# EAGLE design 10DOF_FeatherWing (EAGLE 7.5.0)
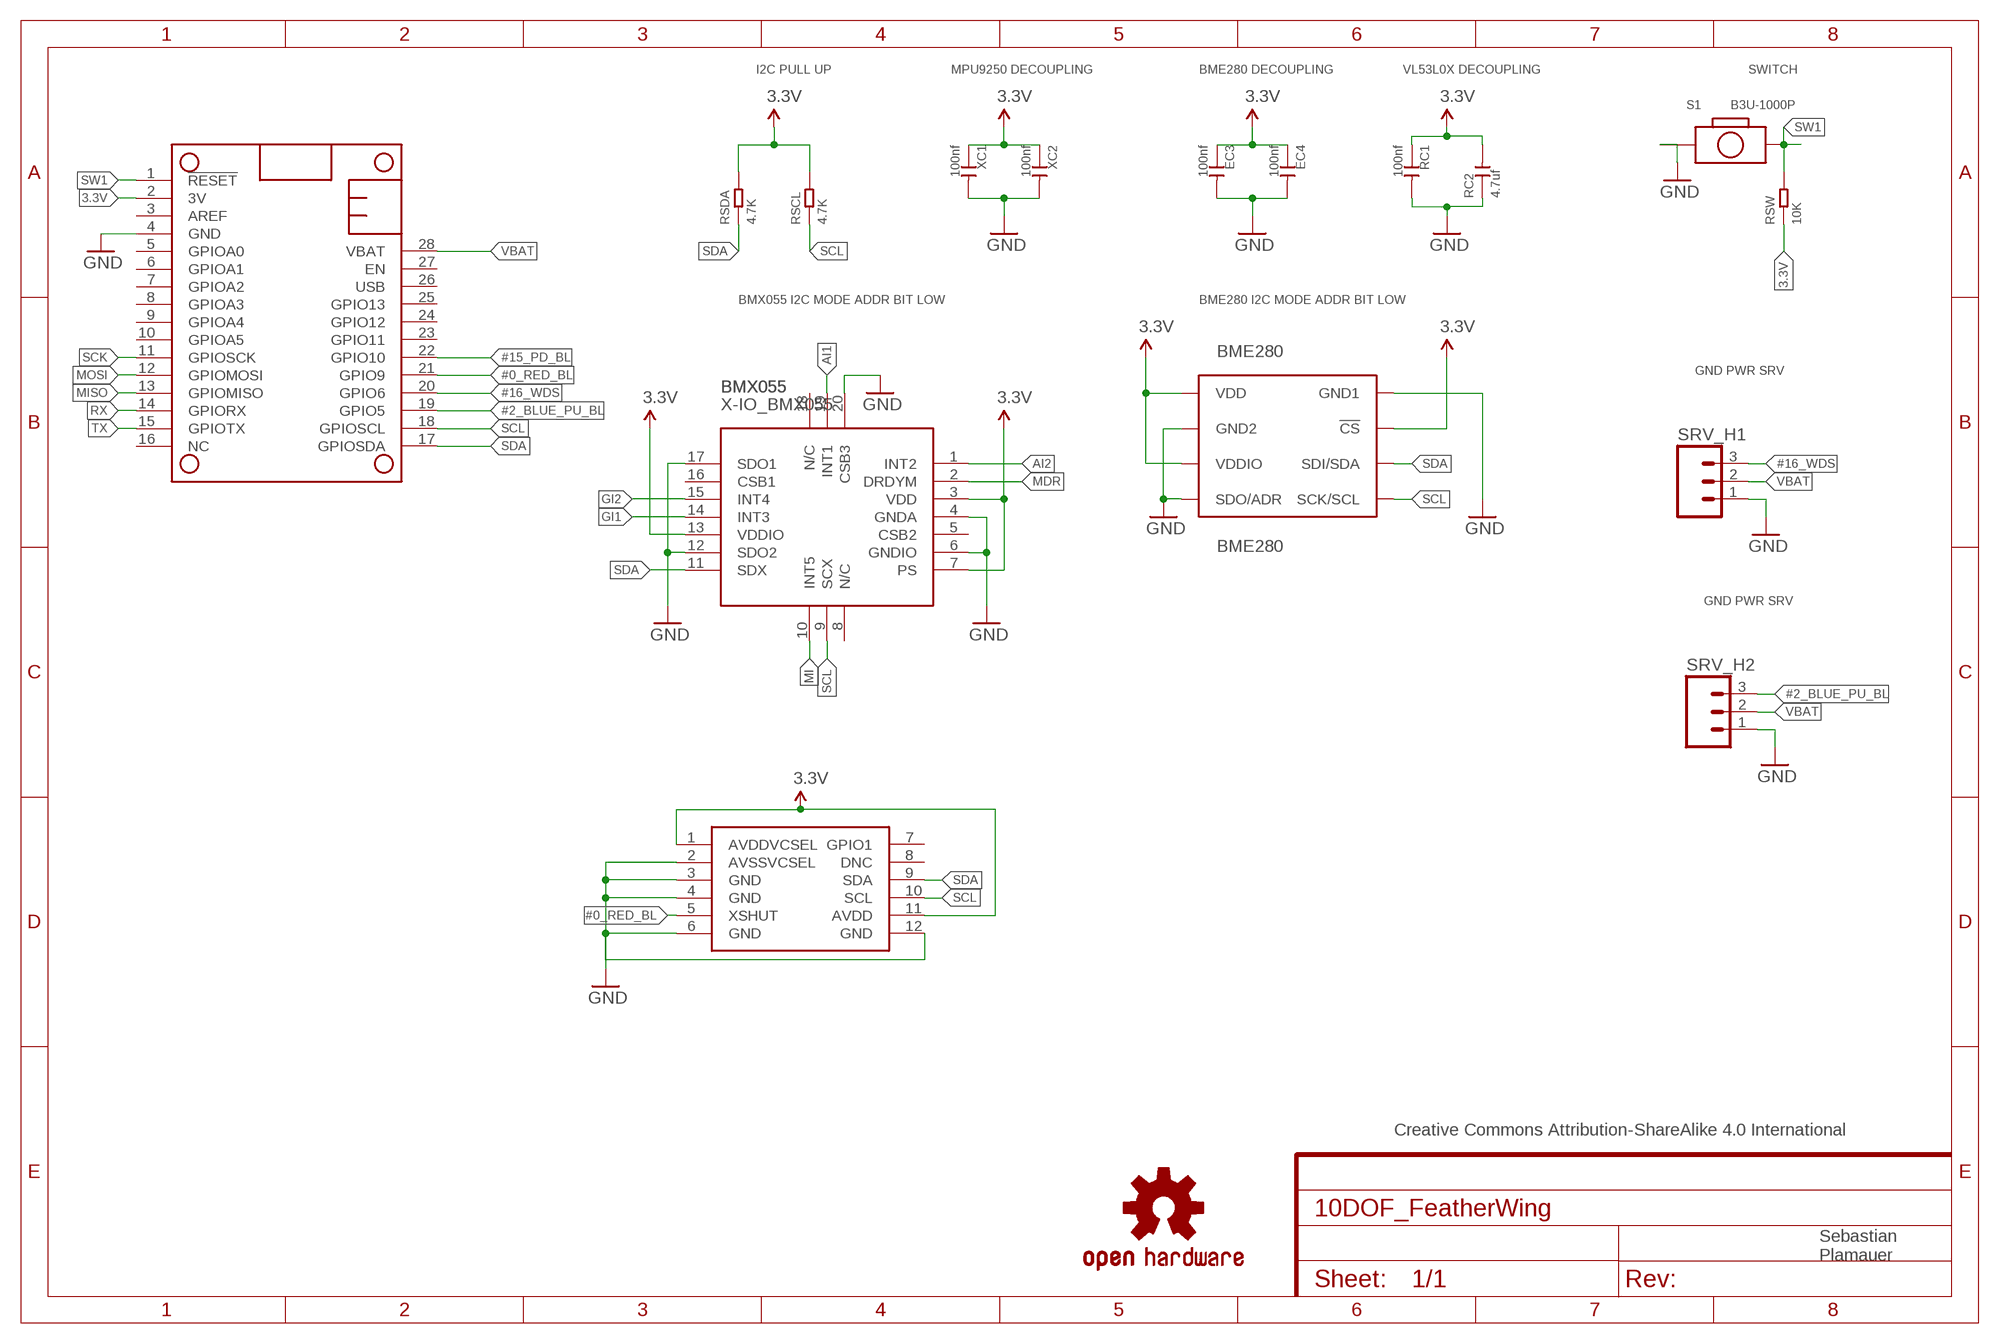
[diagram p0: schematic, sheet 1]

## Parts
BME280  BME280  BME280COMPONENTLIBRARY_BME280  [BME280COMPONENTLIBRARY_BME280_LGA]
BMX055  X-IO_BMX055  [X-IO_BMX055]
EC3  100nf  CERAMIC-100NF-50V-10%-X7R(0603)  [C0603]
EC4  100nf  CERAMIC-100NF-50V-10%-X7R(0603)  [C0603]
LOGO1  OSHW-LOGOS  [OSHW-LOGO-S]
MS1  FEATHERWING  [FEATHERWING]
RC1  100nf  CERAMIC-100NF-50V-10%-X7R(0603)  [C0603]
RC2  4.7uf  CERAMIC-4.7UF-10V-10%-X5R(0603)  [C0603]
RSCL  4.7K  SMD-RES-4.7K-5%-1/10W(0603)  [R0603]
RSDA  4.7K  SMD-RES-4.7K-5%-1/10W(0603)  [R0603]
RSW  10K  SMD-RES-10K-1%-1/10W(0603)  [R0603]
S1  B3U-1000P  SMD-BUTTON-WITHOUT-BOSS-(2P-3X2.5MM)  [SW2-SMD-3.0X2.5X1.2+0.4MM]
SRV_H1  M03PTH  [1X03]
SRV_H2  M03PTH  [1X03]
U$1  VL53L0X  [VL53L0X]
XC1  100nf  CERAMIC-100NF-50V-10%-X7R(0603)  [C0603]
XC2  100nf  CERAMIC-100NF-50V-10%-X7R(0603)  [C0603]

## Nets
3.3V: BME280.P$2(!CS) BME280.P$6(VDDIO) BME280.P$8(VDD) BMX055.3(VDD) BMX055.7(PS) BMX055.13(VDDIO) EC3.1 EC4.1 MS1.2(3V) RC1.1 RC2.2 RSCL.2 RSDA.2 RSW.1 U$1.1(AVDDVCSEL) U$1.11(AVDD) XC1.1 XC2.1
#0_RED_BL: MS1.21(GPIO9) U$1.5(XSHUT)
#2_BLUE_PU_BL: MS1.19(GPIO5) SRV_H2.3
#15_PD_BL: MS1.22(GPIO10)
#16_WDS: MS1.20(GPIO6) SRV_H1.3
AI1: BMX055.19(INT1)
AI2: BMX055.1(INT2)
GI1: BMX055.14(INT3)
GI2: BMX055.15(INT4)
GND: BME280.P$1(GND1) BME280.P$5(SDO/ADR) BME280.P$7(GND2) BMX055.4(GNDA) BMX055.6(GNDIO) BMX055.12(SDO2) BMX055.17(SDO1) BMX055.20(CSB3) EC3.2 EC4.2 MS1.4(GND) RC1.2 RC2.1 S1.1 SRV_H1.1 SRV_H2.1 U$1.2(AVSSVCSEL) U$1.3(GND) U$1.4(GND) U$1.6(GND) U$1.12(GND) XC1.2 XC2.2
MDR: BMX055.2(DRDYM)
MI: BMX055.10(INT5)
MISO: MS1.13(GPIOMISO)
MOSI: MS1.12(GPIOMOSI)
RX: MS1.14(GPIORX)
SCK: MS1.11(GPIOSCK)
SCL: BME280.P$4(SCK/SCL) BMX055.9(SCX) MS1.18(GPIOSCL) RSCL.1 U$1.10(SCL)
SDA: BME280.P$3(SDI/SDA) BMX055.11(SDX) MS1.17(GPIOSDA) RSDA.1 U$1.9(SDA)
SW1: MS1.1(!RESET) RSW.2 S1.2
TX: MS1.15(GPIOTX)
VBAT: MS1.28(VBAT) SRV_H1.2 SRV_H2.2
Unconnected: BMX055.5(CSB2) BMX055.8(N/C) BMX055.16(CSB1) BMX055.18(N/C) MS1.3(AREF) MS1.5(GPIOA0) MS1.6(GPIOA1) MS1.7(GPIOA2) MS1.8(GPIOA3) MS1.9(GPIOA4) MS1.10(GPIOA5) MS1.16(NC) MS1.23(GPIO11) MS1.24(GPIO12) MS1.25(GPIO13) MS1.26(USB) MS1.27(EN) U$1.7(GPIO1) U$1.8(DNC)

## Notes on the sheet
- I2C PULL UP | MPU9250 DECOUPLING | BME280 DECOUPLING | VL53L0X DECOUPLING | SWITCH
- BMX055 I2C MODE ADDR BIT LOW | BME280 I2C MODE ADDR BIT LOW
- GND PWR SRV
- GND PWR SRV
- Creative Commons Attribution-ShareAlike 4.0 International
- Sebastian
  Plamauer

## Library data of the parts
BME280 = SparkFun_BME280_Breakout_v10:BME280COMPONENTLIBRARY_BME280; PROD_ID: IC-13090
BMX055 = BMX055 Breakout:X-IO_BMX055
EC3 EC4 RC1 XC1 XC2 = Seeed-OPL-Capacitor:CERAMIC-100NF-50V-10%-X7R(0603): 302010138; MPN: CC0603KRX7R9BB104
LOGO1 = SparkFun-Aesthetics:OSHW-LOGO: Open Source Hardware Logo This logo indicates the piece of hardware it is found on incorporates a OSHW license and/or adheres to the definition of open source hardware found here: http://freedomdefined.org/OSHW
MS1 = adafruit:FEATHERWING
RC2 = Seeed-OPL-Capacitor:CERAMIC-4.7UF-10V-10%-X5R(0603): 302010111; MPN: CC0603KRX5R6BB475
RSCL RSDA = Seeed-OPL-Resistor:SMD-RES-4.7K-5%-1/10W(0603): 301010290; MPN: RC0603JR-074K7L
RSW = Seeed-OPL-Resistor:SMD-RES-10K-1%-1/10W(0603): 301010299; MPN: RC0603FR-0710KL
S1 = Seeed-OPL-Button:SMD-BUTTON-WITHOUT-BOSS-(2P-3X2.5MM): 311020047; MPN: B3U-1000P
SRV_H1 SRV_H2 = SparkFun-Connectors:M03: Header 3 Standard 3-pin 0.1" header. Use with straight break away headers (SKU : PRT-00116), right angle break away headers (PRT-00553), swiss pins (PRT-00743), machine pins (PRT-00117), and female headers (PRT-00115). Molex polarized connector foot print use with SKU : PRT-08232 with associated crimp pins and housings.
U$1 = VL53L0X:VL53L0X

## Board
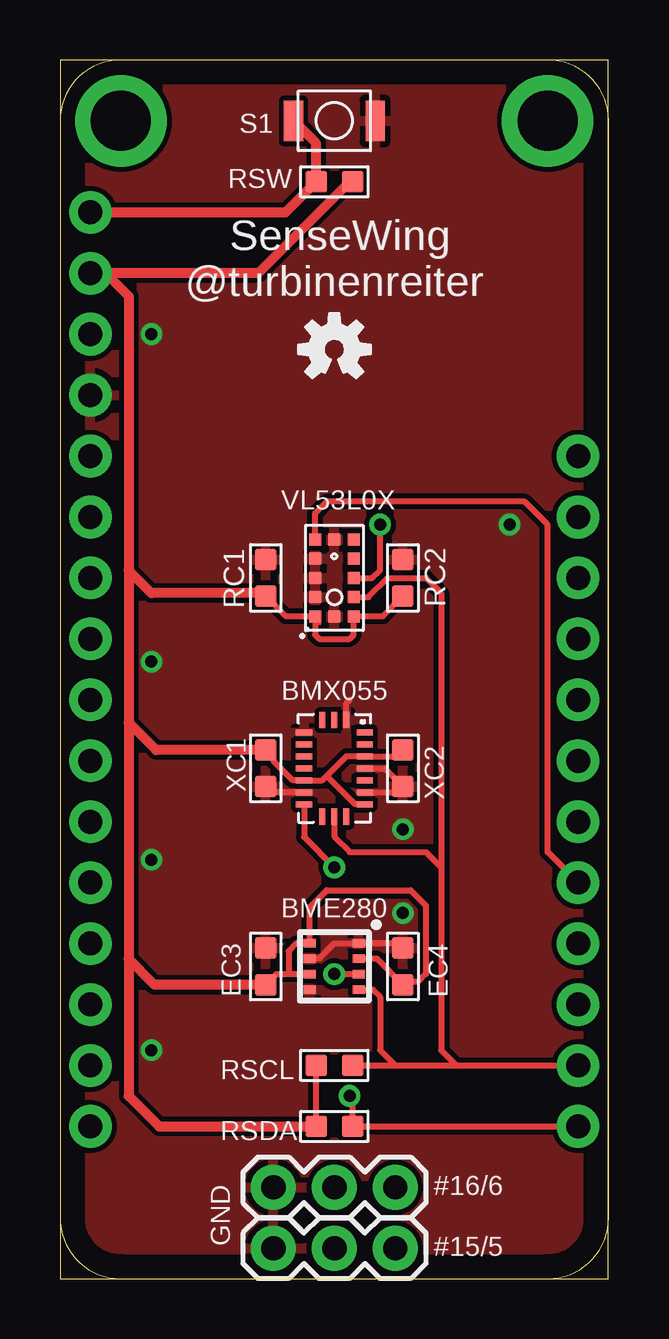
[diagram p1: board, top side]
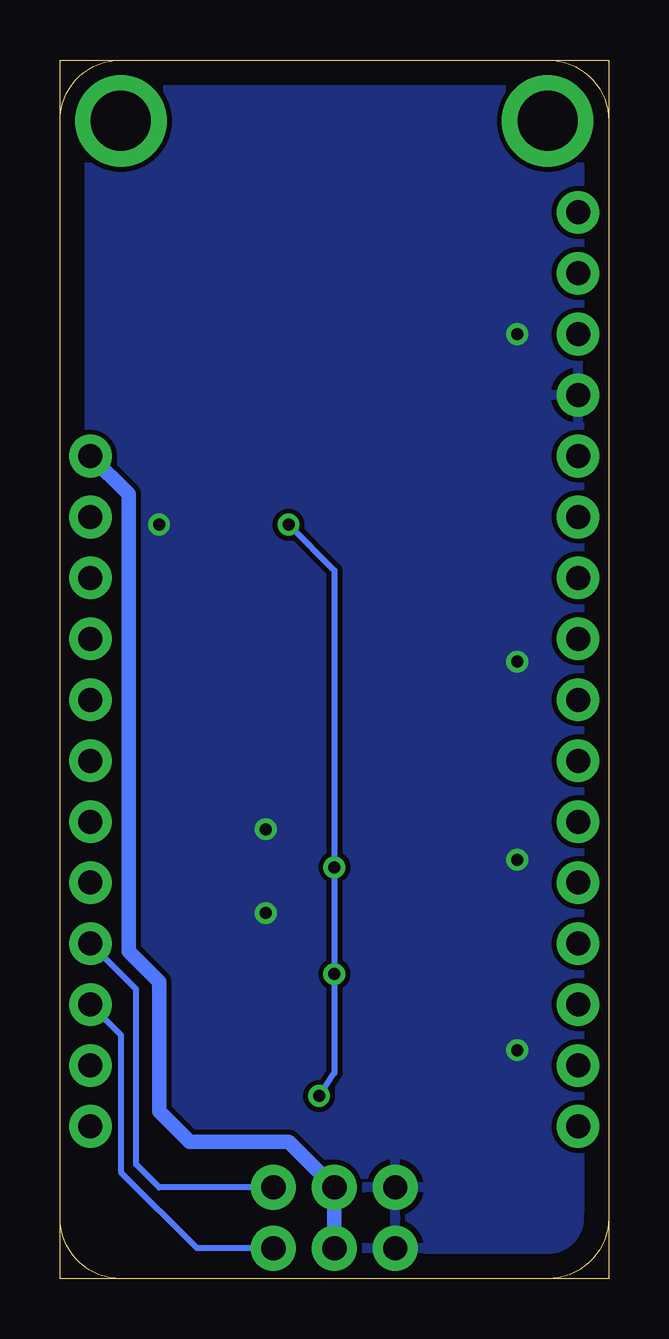
[diagram p2: board, bottom side, seen from below]

Size 22.86 x 50.8 mm. Coordinates in mm from the lower left corner, seen from the top.
Outline: 0,0 22.85,0 22.85,50.79 0,50.79 0,0
Copper layers (1*16): Top 0.035mm / dielectric 1.5mm / Bottom 0.035mm
Design rules "default": minimum track width 10mil, minimum drill 24mil, track to track 8mil, track to pad 8mil, pad to pad 8mil, via to via 8mil, smd to smd 8mil, copper to edge 40mil, drill to drill 8mil, minimum pad ring 10mil, minimum via ring 8mil, stop-mask expansion 4mil, vias tented up to drill 0mil, thermal gap 10mil

### Footprints (pad centres in the part's own frame; a part is rotated, then mirrored left to right if it is on the bottom)
BME280COMPONENTLIBRARY_BME280_LGA = smd 0.5 x 0.35: P$1 1.025,0.975; P$2 1.025,0.325; P$3 1.025,-0.325; P$4 1.025,-0.975; P$5 -1.025,-0.975; P$6 -1.025,-0.325; P$7 -1.025,0.325; P$8 -1.025,0.975
X-IO_BMX055 = smd 0.675 x 0.25: 1 1.262,1.5; 2 1.262,1; 3 1.262,0.5; 4 1.262,0; 5 1.262,-0.5; 6 1.262,-1; 7 1.262,-1.5; 11 -1.262,-1.5; 12 -1.262,-1; 13 -1.262,-0.5; 14 -1.262,0; 15 -1.262,0.5; 16 -1.262,1; 17 -1.262,1.5 | smd 0.25 x 0.675: 8 0.5,-2.013; 9 0,-2.013; 10 -0.5,-2.013; 18 -0.5,2.013; 19 0,2.013; 20 0.5,2.013
C0603 = smd 0.889 x 0.889: 1 0,0.762; 2 0,-0.762
FEATHERWING = drill 1 pad 1.778: 1 6.35,1.27; 2 8.89,1.27; 3 11.43,1.27; 4 13.97,1.27; 5 16.51,1.27; 6 19.05,1.27; 7 21.59,1.27; 8 24.13,1.27; 9 26.67,1.27; 10 29.21,1.27; 11 31.75,1.27; 12 34.29,1.27; 13 36.83,1.27; 14 39.37,1.27; 15 41.91,1.27; 16 44.45,1.27; 17 44.45,21.59; 18 41.91,21.59; 19 39.37,21.59; 20 36.83,21.59; 21 34.29,21.59; 22 31.75,21.59; 23 29.21,21.59; 24 26.67,21.59; 25 24.13,21.59; 26 21.59,21.59; 27 19.05,21.59; 28 16.51,21.59 | drill 2.5 pad 3.81: P$1 2.54,20.32; P$2 2.54,2.54
R0603 = smd 0.889 x 0.889: 1 0,0.762; 2 0,-0.762
SW2-SMD-3.0X2.5X1.2+0.4MM = smd 0.8 x 1.7: 1 -1.7,0; 2 1.7,0
1X03 = drill 1.016 pad 1.88: 1 0,0; 2 2.54,0; 3 5.08,0
VL53L0X = smd 0.5 x 0.5: 1 0.8,1.6; 2 0.8,0.8; 3 0.8,0; 4 0.8,-0.8; 5 0.8,-1.6; 6 0,-1.6; 7 -0.8,-1.6; 8 -0.8,-0.8; 9 -0.8,0; 10 -0.8,0.8; 11 -0.8,1.6; 12 0,1.6

### Placement (x,y rotation side)
BME280  11.43,13.02 0 top
BMX055  11.43,21.27 0 top
EC3  8.57,13.02 180 top
EC4  14.29,13.02 180 top
LOGO1  11.43,38.73 0 top
MS1  0,50.8 270 top
RC1  8.57,29.21 180 top
RC2  14.29,29.21 0 top
RSCL  11.43,8.89 270 top
RSDA  11.43,6.35 270 top
RSW  11.43,45.72 270 top
S1  11.43,48.26 180 top
SRV_H1  8.89,3.81 0 top
SRV_H2  8.89,1.27 0 top
U$1  11.43,29.21 180 top
XC1  8.57,21.27 0 top
XC2  14.29,21.27 0 top

### Tracks (layer width: path | path; a pad name or v marks a point on that pad's centre or on a via)
3.3V
  Top 0.254: 10.79,6.67 10.58,6.45 RSDA.2 RSCL.2 | BME280.P$2 13.2,13.34 EC4.1 14.41,12.38 14.92,12.38 15.24,12.7 15.24,15.56 14.61,16.19 11.11,16.19 10.4,15.48 BME280.P$8 9.87,13.99 9.53,13.65 9.53,12.69 | RC2.2 13.45,27.61 U$1.11 12.23,26.84 12.06,26.67 10.79,26.67 10.63,26.84 U$1.1 9.41,27.61 RC1.1 8.57,28.57 | XC1.1 8.89,21.72 8.89,21.59 9.71,20.77 BMX055.13 10.93,20.77 11.11,20.95 | XC2.1 14.03,21.77 BMX055.3 11.93,21.77 11.11,20.95 | BMX055.7 12.29,19.77 11.11,20.95 | BME280.P$6 9.53,12.69 | 9.53,12.69 9.01,12.69 EC3.1
  Top 0.406: RSW.1 12.06,45.72 8.26,41.91 1.91,41.91 | 1.91,41.91 MS1.2 | 2.86,29.53 2.86,40.96 1.91,41.91 | 2.86,29.53 2.86,23.18 | 2.86,23.18 2.86,13.34 | 2.86,13.34 2.86,7.62 4.13,6.35 RSDA.2 | XC1.1 4,22.04 2.86,23.18 | 8.57,28.57 3.81,28.57 2.86,29.53 | EC3.1 3.94,12.26 2.86,13.34
#0_RED_BL
  Top 0.254: MS1.21 20.32,17.78 20.32,31.43 19.37,32.38 11.11,32.38 10.63,31.9 U$1.5
#2_BLUE_PU_BL
  Bottom 0.254: MS1.19 20.32,10.16 20.32,4.45 17.14,1.27 SRV_H2.3
#16_WDS
  Bottom 0.254: SRV_H1.3 18.73,3.81 19.68,4.76 19.68,12.06 MS1.20
GND  (via drill 0.5)
  Top 0.254: EC4.2 14.07,13.99 BME280.P$1 12.43,13.97 11.43,13.97 10.8,13.34 BME280.P$7 | BMX055.12 8.81,20.27 XC1.2 | BMX055.6 14.05,20.27 XC2.2 13.53,21.27 BMX055.4 | BMX055.20 11.93,24 12.06,24.13
  other vias: 3.81,39.37 3.81,25.72 3.81,17.46 3.81,9.53 18.73,31.43 14.29,18.73 14.29,15.24
  pour Top: 23.81,-0.64 23.81,51.44 -0.64,51.44 -0.64,-0.64
  pour Bottom: 0,0 23.18,0 23.18,50.8 0,50.8
SCL
  Top 0.254: RSCL.1 13.97,8.89 | 13.97,8.89 16.51,8.89 | 16.51,8.89 MS1.18 | BMX055.9 11.43,18.41 12.06,17.78 15.24,17.78 15.88,17.14 | 15.88,17.14 15.88,9.53 16.51,8.89 | 15.88,17.14 15.88,28.57 15.24,29.21 13.65,29.21 12.85,28.41 U$1.10 | BME280.P$4 13.04,12.04 13.34,11.75 13.34,9.53 13.97,8.89
SDA  (via drill 0.5)
  Top 0.254: MS1.17 RSDA.1 12.19,7.43 v12.06,7.62 | BME280.P$3 11.76,12.69 v11.43,12.7 | BMX055.11 10.17,18.41 v11.43,17.14 | U$1.9 13.02,29.21 13.34,29.53 v13.34,31.43
  Bottom 0.254: v12.06,7.62 11.43,8.57 v11.43,12.7 v11.43,17.14 11.43,29.53 v13.34,31.43
SW1
  Top 0.406: S1.2 10.67,47.32 RSW.2 9.4,44.45 MS1.1
VBAT
  Bottom 0.61: SRV_H2.2 SRV_H1.2 13.34,5.71 17.46,5.71 18.73,6.99 18.73,12.38 20,13.65 20,32.7 MS1.28

### Text on the board
tNames: SenseWing / @turbinenreiter | VL53L0X | #16/6 | GND | #15/5